# Altium schematic sheet scanline.SchDoc
size A
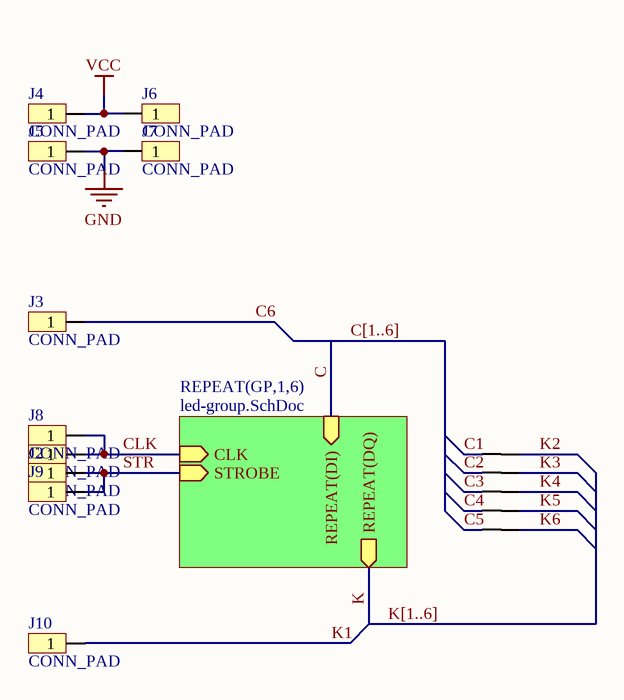
[diagram p0: scanline.SchDoc]

## Parts
J1  CONN_PAD
J2  CONN_PAD
J3  CONN_PAD
J4  CONN_PAD
J5  CONN_PAD
J6  CONN_PAD
J7  CONN_PAD
J8  CONN_PAD
J9  CONN_PAD
J10  CONN_PAD
T2  NETTIE  [NETTIE]  (value not drawn)  (net tie, no BOM)
T3  NETTIE  [NETTIE]  (value not drawn)  (net tie, no BOM)
T4  NETTIE  [NETTIE]  (value not drawn)  (net tie, no BOM)
T5  NETTIE  [NETTIE]  (value not drawn)  (net tie, no BOM)
T6  NETTIE  [NETTIE]  (value not drawn)  (net tie, no BOM)

## Sub-sheets
REPEAT(GP,1,6) = led-group.SchDoc: CLK (in), REPEAT(DI) (in), REPEAT(DQ) (out), STROBE (in)

## Nets
GND: J5.1 J7.1
VCC: J4.1 J6.1
C: sheet REPEAT(GP,1,6)/REPEAT(DI)
C1: T2.1
C2: T3.1
C3: T4.1
C4: T5.1
C5: T6.1
C6: J3.1
CLK: J1.1 J8.1 ; sheet REPEAT(GP,1,6)/CLK
K: sheet REPEAT(GP,1,6)/REPEAT(DQ)
K1: J10.1
K2: T2.2
K3: T3.2
K4: T4.2
K5: T5.2
K6: T6.2
STR: J2.1 J9.1 ; sheet REPEAT(GP,1,6)/STROBE

## Buses and harness runs
bus C[1..6]
bus K[1..6]